# EAGLE schematic T01_411_Synth_v2.1 (EAGLE 7.1.0)
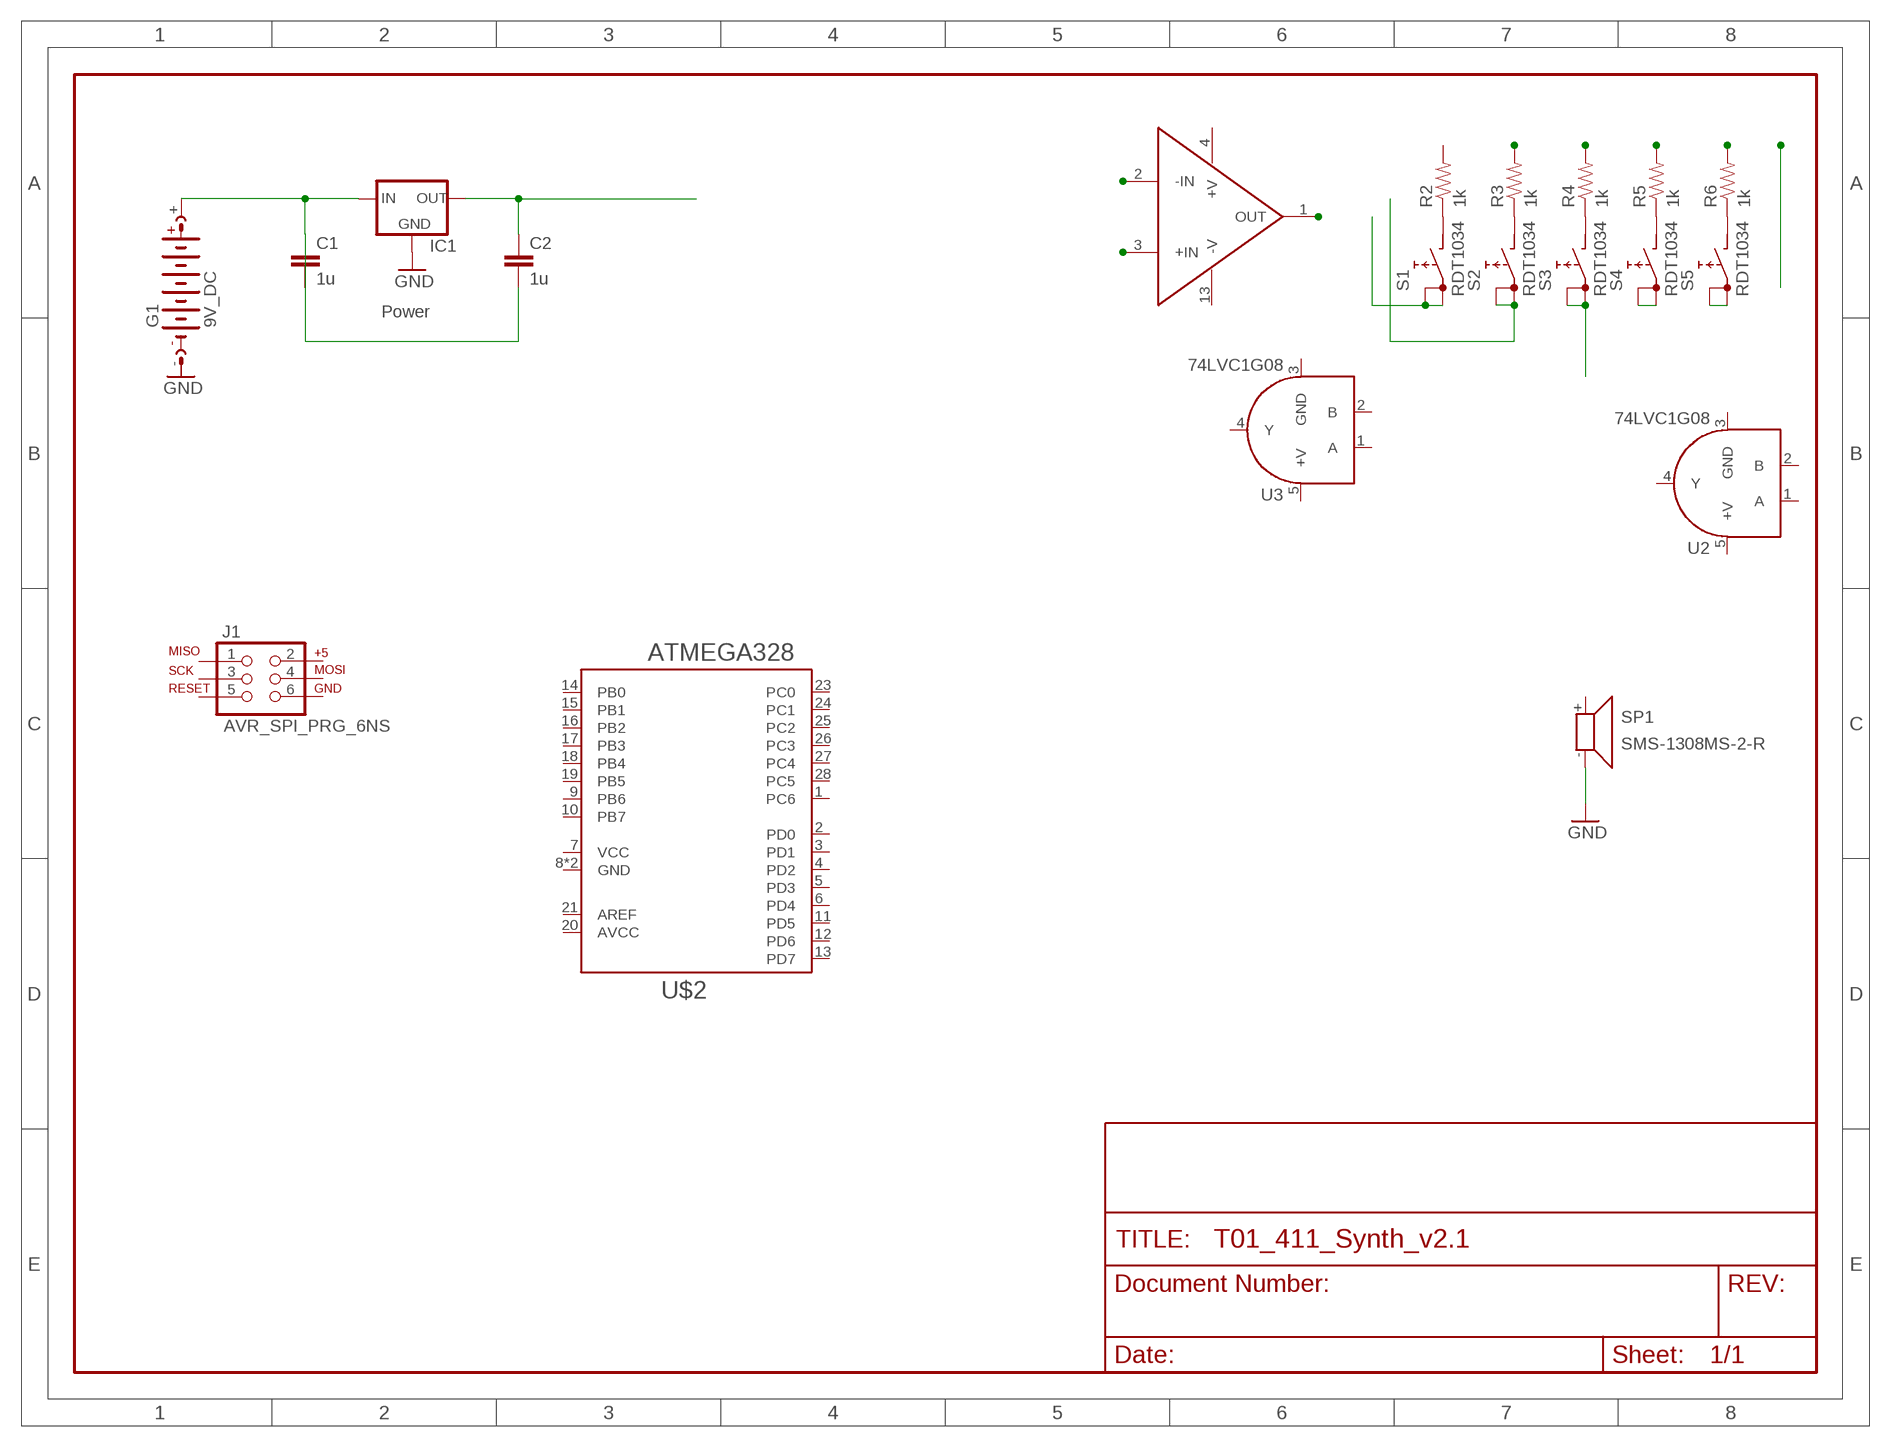
[diagram p0: schematic, sheet 1]

## Parts
C1  1u  CAP0603-CAP  [0603-CAP]
C2  1u  CAP0603-CAP  [0603-CAP]
G1  9V_DC  AB9V  [AB9V]
IC1  78LXX  [78LXX]
J1  AVR_SPI_PRG_6NS  [2X3-NS]
R2  1k  RESISTOR0603  [0603-RES]
R3  1k  RESISTOR0603  [0603-RES]
R4  1k  RESISTOR0603  [0603-RES]
R5  1k  RESISTOR0603  [0603-RES]
R6  1k  RESISTOR0603  [0603-RES]
S1  RDT1034  [RDT1034]
S2  RDT1034  [RDT1034]
S3  RDT1034  [RDT1034]
S4  RDT1034  [RDT1034]
S5  RDT1034  [RDT1034]
SP1  SMS-1308MS-2-R  [SMS-1308MS-2-R]
U2  74LVC1G08  SN74LVC1G08  [SOT23-5]
U3  74LVC1G08  SN74LVC1G08  [SOT23-5]
U$1  LT1014  [SO16L]
U$2  ATMEGA328  [DIL28-3]

## Nets
GND: IC1.GND SP1.-
N$1: C1.1 C1.2 C2.2 G1.+ IC1.IN
N$4: C2.1 IC1.OUT
N$8: S3.A S3.A1
N$10: S5.A S5.A1
N$11: R2.1 S1.B
N$12: R3.1 S2.B
N$13: R4.1 S3.B
N$14: R5.1 S4.B
N$15: R6.1 S5.B
N$17: R6.2
N$18: R5.2
N$19: S1.A S1.A1
N$21: S2.A S2.A1
N$22: S4.A S4.A1
N$24: R4.2
N$25: U$1.1(OUT)
N$26: R3.2
N$27: U$1.3(+IN)
N$28: U$1.2(-IN)
Unconnected: G1.- J1.1 J1.2 J1.3 J1.4 J1.5 J1.6 R2.2 SP1.+ U2.1(A) U2.2(B) U2.4(Y) U3.1(A) U3.2(B) U3.4(Y) U$2.1(PC6) U$2.2(PD0) U$2.3(PD1) U$2.4(PD2) U$2.5(PD3) U$2.6(PD4) U$2.9(PB6) U$2.10(PB7) U$2.11(PD5) U$2.12(PD6) U$2.13(PD7) U$2.14(PB0) U$2.15(PB1) U$2.16(PB2) U$2.17(PB3) U$2.18(PB4) U$2.19(PB5) U$2.23(PC0) U$2.24(PC1) U$2.25(PC2) U$2.26(PC3) U$2.27(PC4) U$2.28(PC5)

## Notes on the sheet
- Power

## Power pins joined to a net without a drawn wire
+IN: U$1.5(+IN) U$1.12(+IN) U$1.14(+IN)
+V: U2.5(+V) U3.5(+V) U$1.4(+V)
-IN: U$1.6(-IN) U$1.11(-IN) U$1.15(-IN)
-V: U$1.13(-V)
AREF: U$2.21(AREF)
AVCC: U$2.20(AVCC)
GND: U2.3(GND) U3.3(GND) U$2.8(GND) U$2.22(GND)
OUT: U$1.7(OUT) U$1.10(OUT) U$1.16(OUT)
VCC: U$2.7(VCC)

## Library data of the parts
C1 C2 = SparkFun-Capacitors:CAP: Capacitor Standard 0603 ceramic capacitor, and 0.1" leaded capacitor.
G1 = battery:AB9V: 9-V BATTERY CLIP
IC1 = v-reg:78LXX: VOLTAGE REGULATOR
J1 = SparkFun-Connectors:AVR_SPI_PRG_6: AVR ISP 6 Pin This is the reduced ISP connector for AVR programming. Common on Arduino. This footprint will take up less PCB space and can be used with a 10-pin to 6-pin adapter such as SKU: BOB-08508 **Special note about "TEST_POINT" package. The stop mask is on the top side, so if you want your programming test points to be on the bottom of your board, make sure to place this package on the bottom side of the board. This also ensure that the orientation to program from the bottom side will be correct.
R2-R6 = SparkFun-Resistors:RESISTOR: Resistor Basic schematic elements and footprints for 0603, 1206, and PTH resistors.
S1-S5 = switch:RDT1034: PUSH SWITCH www.radiohm.com
SP1 = speaker:SMS-1308MS-2-R: Speaker 13 x 13mm, 8 Ohm, 0.7W Source: pui audio inc. SMS-1308MS-2-R.pdf
U2 U3 = SparkFun-DigitalIC:SN74LVC1G08: Single-gate AND logic; PROD_ID: 10841
U$1 = SparkFun-AnalogIC:LT1014: Precision quad op-amp. I/O range includes negative rail.
U$2 = libV2:ATMEGA328: Atmel 8-bit Microcontroller source: http://www.atmel.com/images/atmel-8271-8-bit-avr-microcontroller-atmega48a-48pa-88a-88pa-168a-168pa-328-328p_datasheet_summary.pdf; DIGIKEY: http://www.digikey.com/product-detail/en/ATMEGA328-PU/ATMEGA328-PU-ND/2271026